# EAGLE design PsOne_LED_Driver (EAGLE 9.6.2)
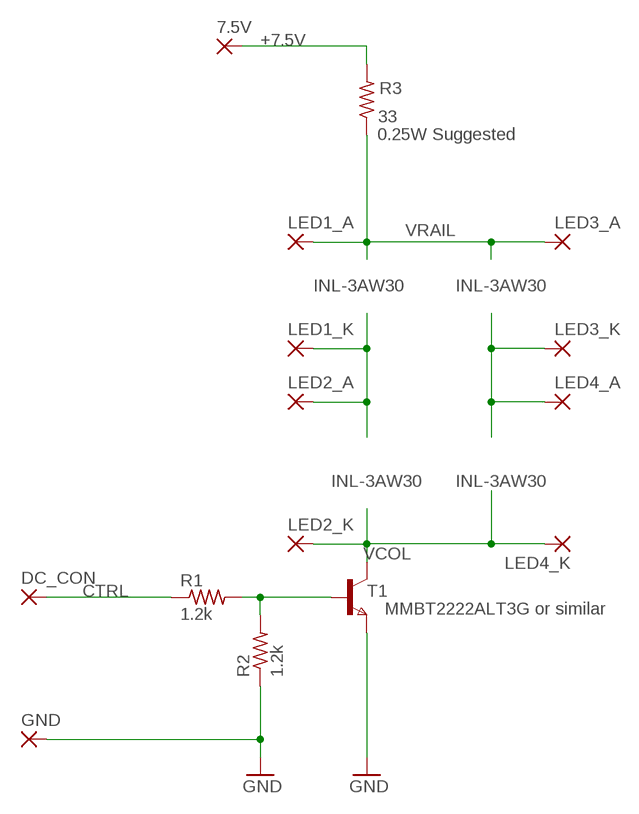
[diagram p0: schematic, sheet 1]

## Parts
7.5V  SMD5  [SMD2,54-5,08]
DC_CON  SMD5  [SMD2,54-5,08]
GND  SMD5  [SMD2,54-5,08]
LED1_A  SMD2  [SMD1,27-2,54]
LED1_K  SMD2  [SMD1,27-2,54]
LED2_A  SMD2  [SMD1,27-2,54]
LED2_K  SMD2  [SMD1,27-2,54]
LED3_A  SMD2  [SMD1,27-2,54]
LED3_K  SMD2  [SMD1,27-2,54]
LED4_A  SMD2  [SMD1,27-2,54]
LED4_K  SMD2  [SMD1,27-2,54]
R1  1.2k  R-US_R0603  [R0603]
R2  1.2k  R-US_R0603  [R0603]
R3  33  R-US_R1206  [R1206]
T1  NPNSOT23  [SOT-23]

## Nets
+7.5V: 7.5V.1(P) R3.2
CTRL: DC_CON.1(P) R1.1
GND: GND.1(P) R2.1 T1.2(E)
N$3: LED3_K.1(P) LED4_A.1(P)
N$4: R1.2 R2.2 T1.3(B)
N$5: LED1_K.1(P) LED2_A.1(P)
VCOL: LED2_K.1(P) LED4_K.1(P) T1.1(C)
VRAIL: LED1_A.1(P) LED3_A.1(P) R3.1

## Notes on the sheet
- 0.25W Suggested
- INL-3AW30 | INL-3AW30
- INL-3AW30 | INL-3AW30
- MMBT2222ALT3G or similar

## Library data of the parts
7.5V DC_CON GND = wirepad:SMD5: SMD PAD
LED1_A LED1_K LED2_A LED2_K LED3_A LED3_K LED4_A LED4_K = wirepad:SMD2: SMD PAD
R1-R3 = rcl:R-US_: RESISTOR, American symbol; SPICEPREFIX: R
T1 = zetex:NPNSOT23: NPN TRANSISTOR; MPN: DSS20201L-7; OC_FARNELL: 1710688; OC_NEWARK: 25R4555

## Board
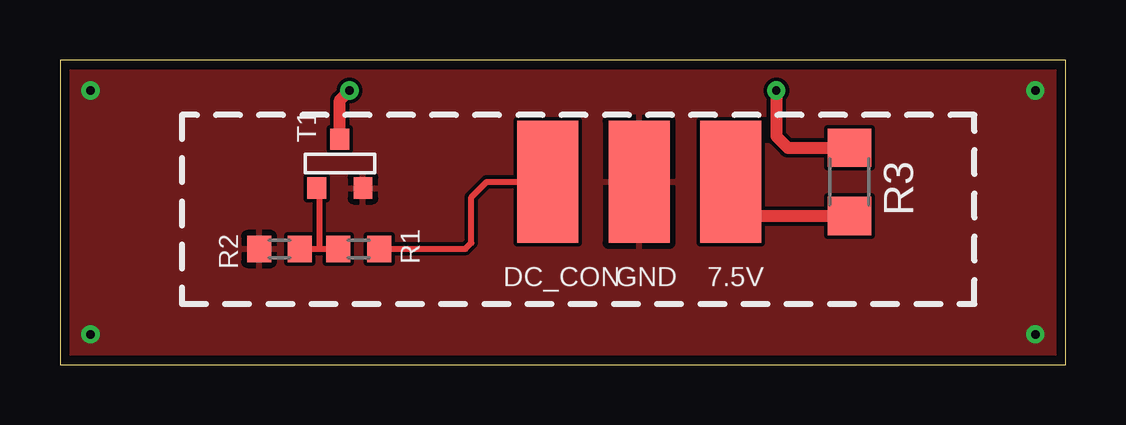
[diagram p1: board, top side]
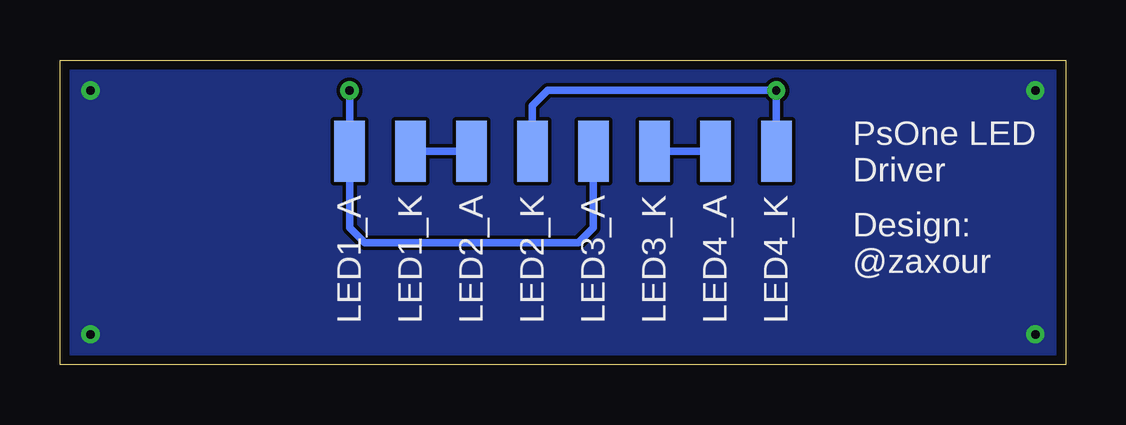
[diagram p2: board, bottom side, seen from below]

Size 41.91 x 12.7 mm. Coordinates in mm from the lower left corner, seen from the top.
Outline: 0,0 41.91,0 41.91,12.7 0,12.7 0,0
Copper layers (1*16): Top 0.035mm / dielectric 1.5mm / Bottom 0.035mm
Design rules "default *": minimum track width 6mil, minimum drill 0.3mm, track to track 6mil, track to pad 6mil, pad to pad 6mil, via to via 6mil, smd to smd 6mil, copper to edge 15mil, drill to drill 6mil, minimum pad ring 10mil, minimum via ring 8mil, stop-mask expansion 4mil, vias tented up to drill 20mil, thermal gap 10mil

### Footprints (pad centres in the part's own frame; a part is rotated, then mirrored left to right if it is on the bottom)
SMD2,54-5,08 = smd 2.54 x 5.08: 1 0,0
SMD1,27-2,54 = smd 1.27 x 2.54: 1 0,0
R0603 = smd 1 x 1.1: 1 -0.85,0; 2 0.85,0
R1206 = smd 1.6 x 1.803: 1 -1.422,0; 2 1.422,0
SOT-23 = smd 0.787 x 0.889: 1 0.025,-1.016; 2 -0.94,1.016; 3 0.991,1.016

### Placement (x,y rotation side)
7.5V  27.94,7.62 0 top
DC_CON  20.32,7.62 0 top
GND  24.13,7.62 0 top
LED1_A  29.84,8.89 0 bottom
LED1_K  27.3,8.89 0 bottom
LED2_A  24.77,8.89 0 bottom
LED2_K  22.23,8.89 0 bottom
LED3_A  19.68,8.89 0 bottom
LED3_K  17.14,8.89 0 bottom
LED4_A  14.61,8.89 0 bottom
LED4_K  12.06,8.89 0 bottom
R1  12.45,4.83 180 top
R2  9.14,4.83 0 top
R3  32.89,7.62 270 top
T1  11.68,8.38 180 top

### Tracks (layer width: path | path; a pad name or v marks a point on that pad's centre or on a via)
+7.5V
  Top 0.508: R3.2 28.09,6.2 27.94,6.35 7.5V.1
CTRL
  Top 0.254: R1.1 16.89,4.83 17.14,5.08 17.14,6.99 17.78,7.62 DC_CON.1
GND  (via drill 0.35)
  other vias: 1.27,11.43 1.27,1.27 40.64,1.27 40.64,11.43
  pour Top: -1.27,15.24 -1.27,-5.08 53.34,-5.08 53.34,15.24
  pour Bottom: 43.18,13.97 43.18,-1.27 -1.27,-1.27 -1.27,13.97
N$3
  Bottom 0.305: LED4_A.1 LED3_K.1
N$4
  Top 0.254: R2.2 10.79,4.83 | 10.79,4.83 R1.2 | T1.3 10.79,7.26 10.79,4.83
N$5
  Bottom 0.305: LED1_K.1 LED2_A.1
VCOL  (via drill 0.35)
  Top 0.508: T1.1 11.66,11.02 v12.06,11.43
  Bottom 0.305: LED4_K.1 v12.06,11.43 21.59,11.43 22.23,10.79 LED2_K.1
VRAIL  (via drill 0.35)
  Top 0.508: v29.84,11.43 29.84,9.53 30.33,9.04 R3.1
  Bottom 0.305: LED3_A.1 19.68,5.71 20.32,5.08 29.21,5.08 29.84,5.71 LED1_A.1 v29.84,11.43

### Text on the board
bPlace: PsOne LED / Driver | Design: / @zaxour